# EAGLE schematic STM32 control board - ESCD (EAGLE 9.6.2)
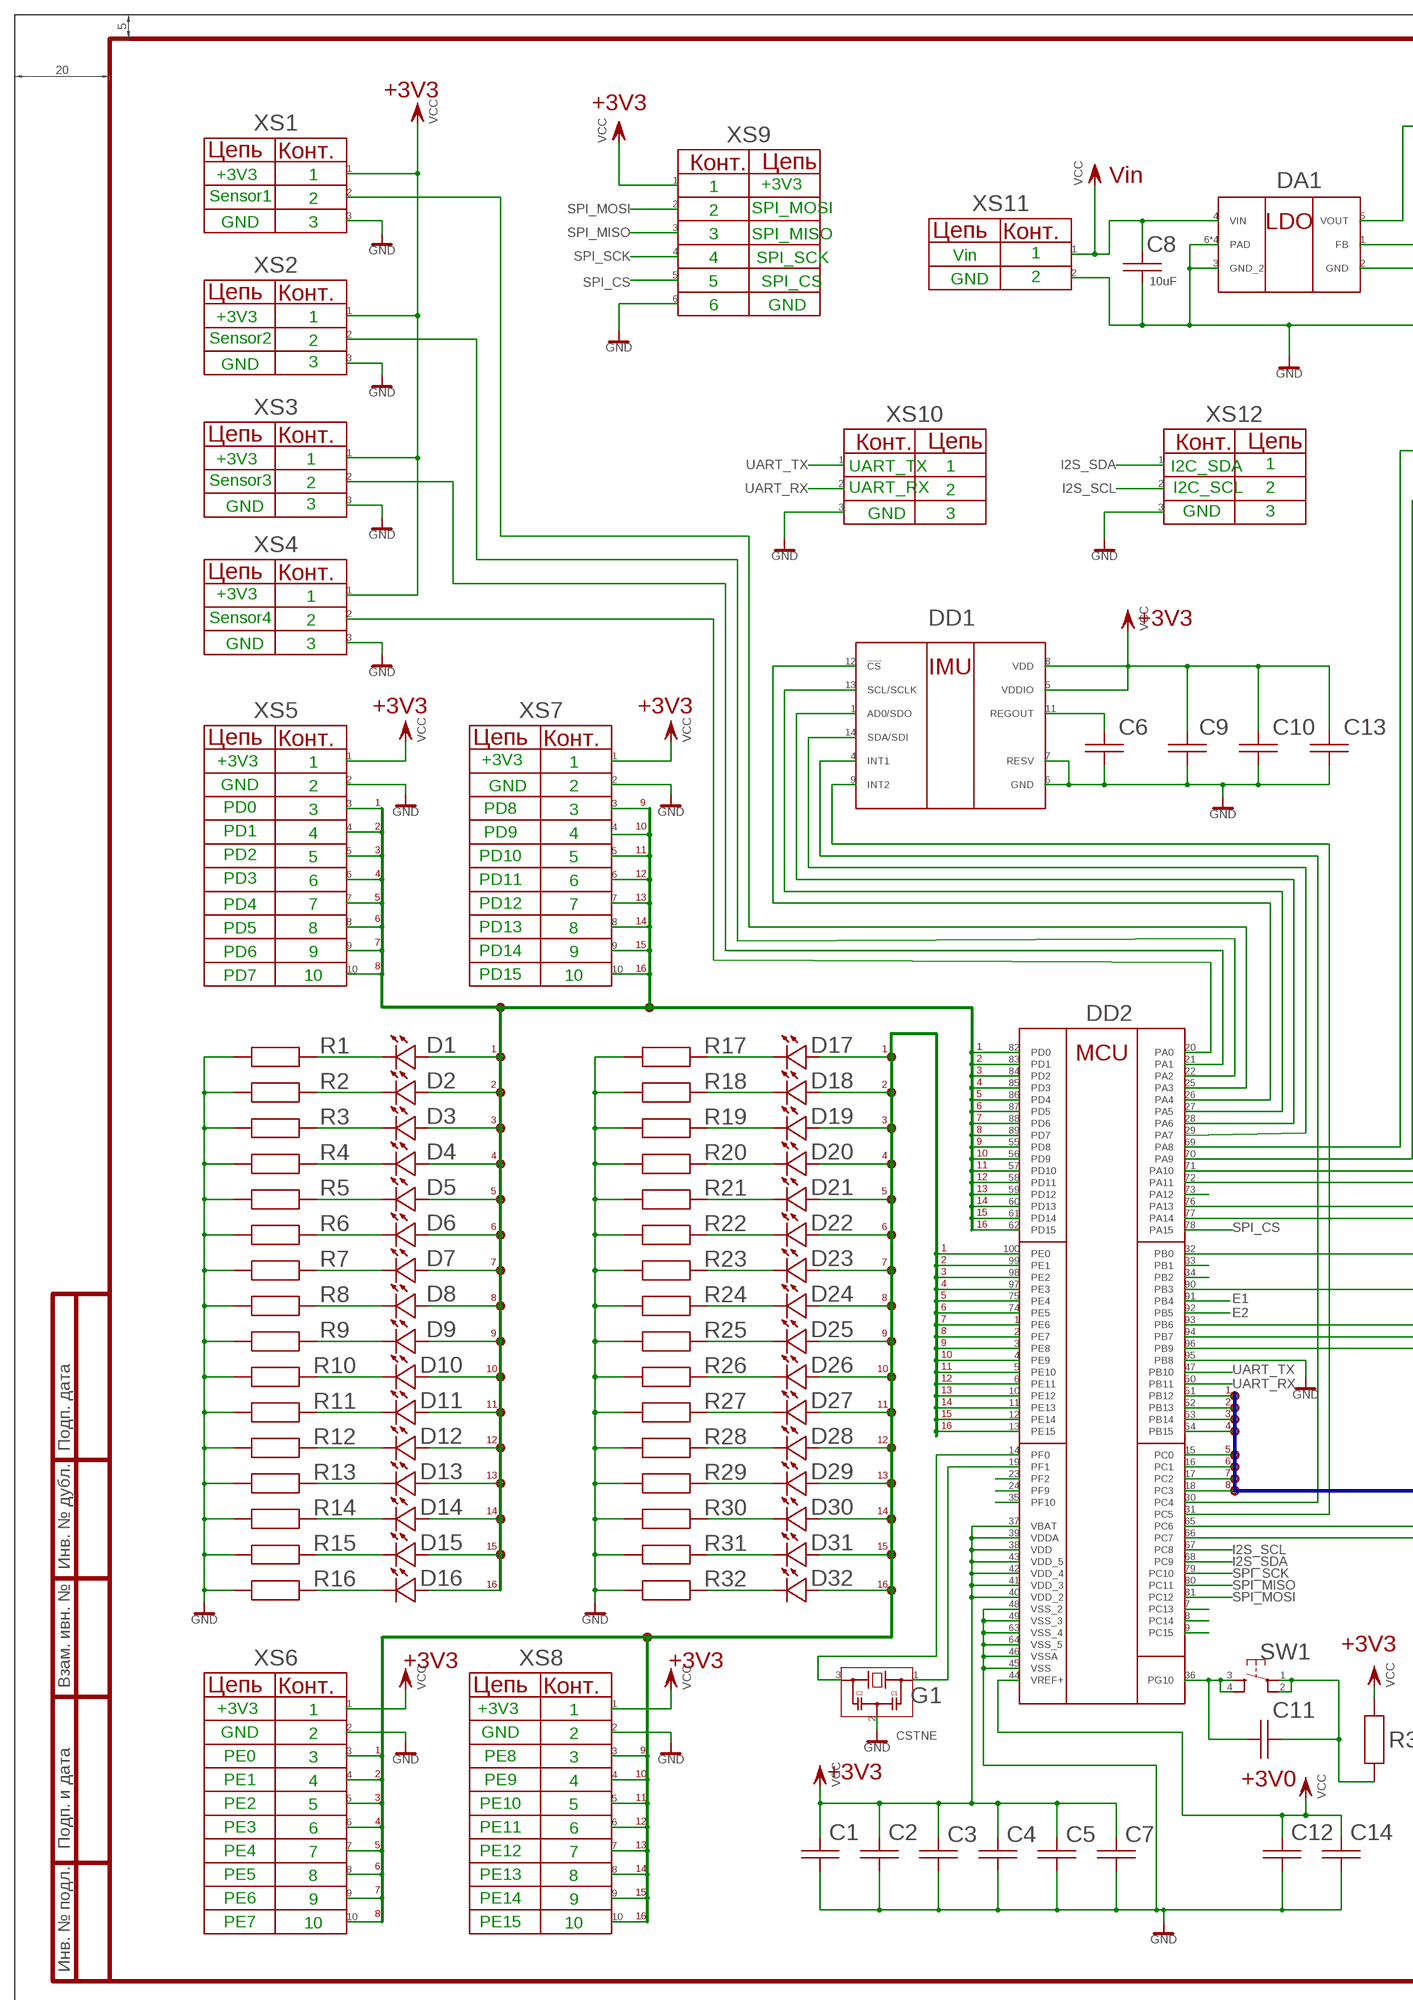
[diagram p0: schematic, sheet 1, part 1 of 2]
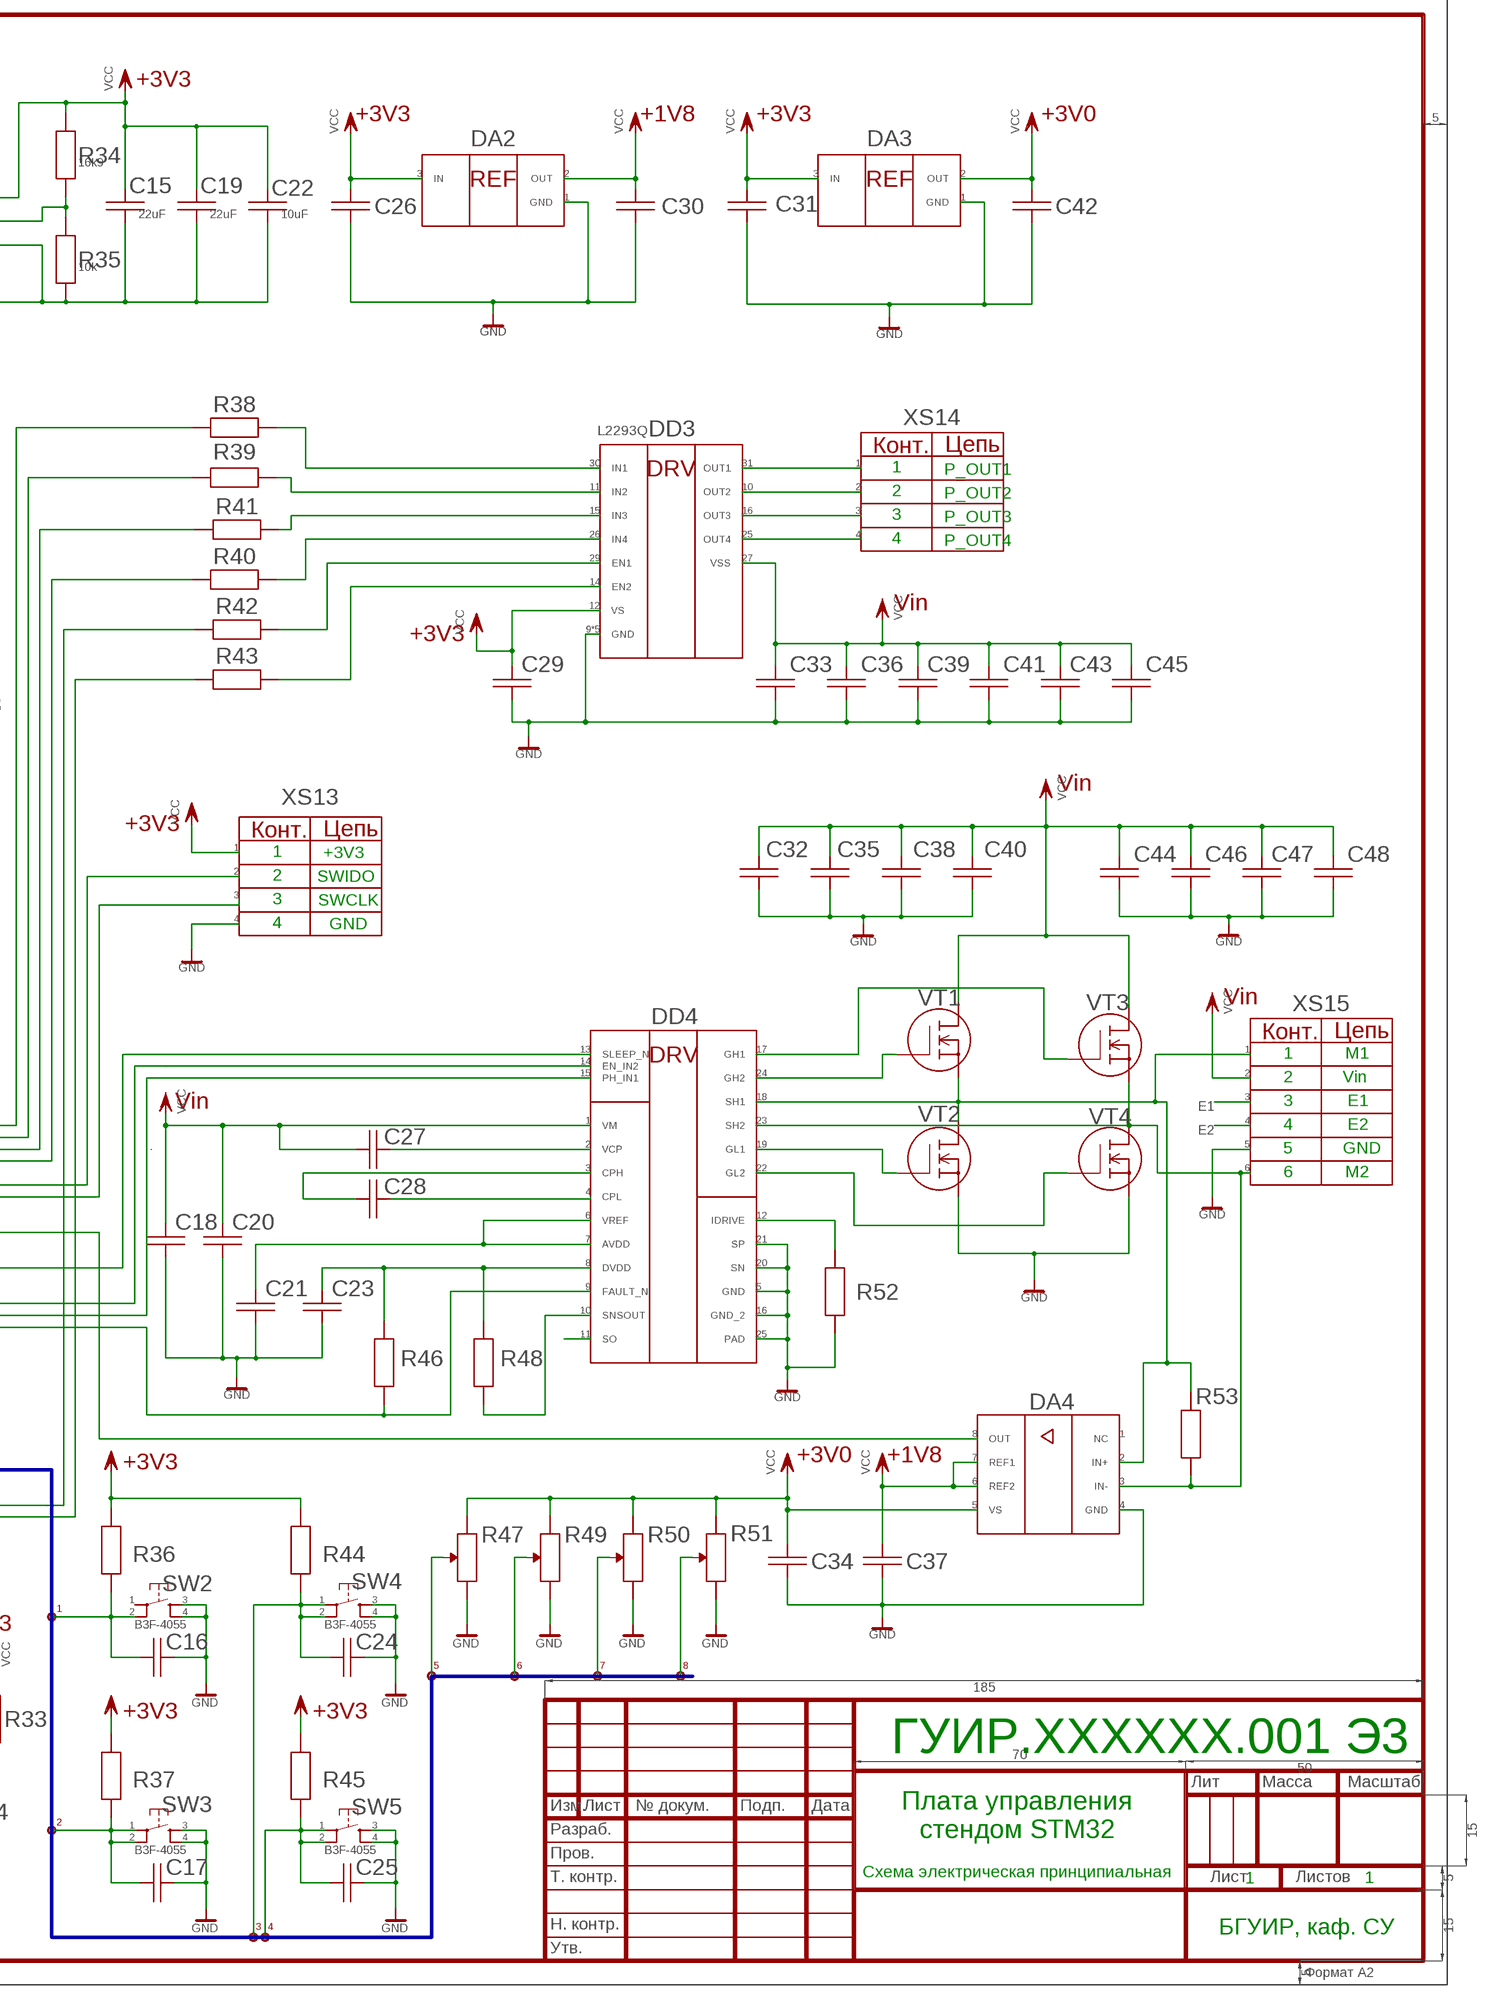
[diagram p1: schematic, sheet 1, part 2 of 2]

## Parts
C1  ESCD_CAP  [C1206]
C2  ESCD_CAP  [C1206]
C3  ESCD_CAP  [C1206]
C4  ESCD_CAP  [C1206]
C5  ESCD_CAP  [C1206]
C6  ESCD_CAP  [C1206]
C7  ESCD_CAP  [C1206]
C8  10uF  ESCD_CAP  [C1206]
C9  ESCD_CAP  [C1206]
C10  ESCD_CAP  [C1206]
C11  ESCD_CAP  [C1206]
C12  ESCD_CAP  [C1206]
C13  ESCD_CAP  [C1206]
C14  ESCD_CAP  [C1206]
C15  22uF  ESCD_CAP  [C1206]
C16  100nF  ESCD_CAP  [C1206]
C17  100nF  ESCD_CAP  [C1206]
C18  ESCD_CAP  [C1206]
C19  22uF  ESCD_CAP  [C1206]
C20  ESCD_CAP  [C1206]
C21  ESCD_CAP  [C1206]
C22  10uF  ESCD_CAP  [C1206]
C23  ESCD_CAP  [C1206]
C24  100nF  ESCD_CAP  [C1206]
C25  100nF  ESCD_CAP  [C1206]
C26  ESCD_CAP  [C1206]
C27  ESCD_CAP  [C1206]
C28  ESCD_CAP  [C1206]
C29  ESCD_CAP  [C1206]
C30  ESCD_CAP  [C1206]
C31  ESCD_CAP  [C1206]
C32  ESCD_CAP  [C1206]
C33  ESCD_CAP  [C1206]
C34  ESCD_CAP  [C1206]
C35  ESCD_CAP  [C1206]
C36  ESCD_CAP  [C1206]
C37  ESCD_CAP  [C1206]
C38  ESCD_CAP  [C1206]
C39  ESCD_CAP  [C1206]
C40  ESCD_CAP  [C1206]
C41  ESCD_CAP  [C1206]
C42  ESCD_CAP  [C1206]
C43  ESCD_CAP  [C1206]
C44  ESCD_CAP  [C1206]
C45  ESCD_CAP  [C1206]
C46  ESCD_CAP  [C1206]
C47  ESCD_CAP  [C1206]
C48  ESCD_CAP  [C1206]
D1  ESCD_LED  [SOD106A]
D2  ESCD_LED  [SOD106A]
D3  ESCD_LED  [SOD106A]
D4  ESCD_LED  [SOD106A]
D5  ESCD_LED  [SOD106A]
D6  ESCD_LED  [SOD106A]
D7  ESCD_LED  [SOD106A]
D8  ESCD_LED  [SOD106A]
D9  ESCD_LED  [SOD106A]
D10  ESCD_LED  [SOD106A]
D11  ESCD_LED  [SOD106A]
D12  ESCD_LED  [SOD106A]
D13  ESCD_LED  [SOD106A]
D14  ESCD_LED  [SOD106A]
D15  ESCD_LED  [SOD106A]
D16  ESCD_LED  [SOD106A]
D17  ESCD_LED  [SOD106A]
D18  ESCD_LED  [SOD106A]
D19  ESCD_LED  [SOD106A]
D20  ESCD_LED  [SOD106A]
D21  ESCD_LED  [SOD106A]
D22  ESCD_LED  [SOD106A]
D23  ESCD_LED  [SOD106A]
D24  ESCD_LED  [SOD106A]
D25  ESCD_LED  [SOD106A]
D26  ESCD_LED  [SOD106A]
D27  ESCD_LED  [SOD106A]
D28  ESCD_LED  [SOD106A]
D29  ESCD_LED  [SOD106A]
D30  ESCD_LED  [SOD106A]
D31  ESCD_LED  [SOD106A]
D32  ESCD_LED  [SOD106A]
DA1  ESCD_LDOSON8  [DRB0008B]
DA2  ESCD_REF  [SOT-23-3]
DA3  ESCD_REF  [SOT-23-3]
DA4  INA240_TSSOP  [TSSOP-8]
DD1  ICM_20600  [14_PIN_LGA]
DD2  ESCD_STM32G4_LPQFP100  [LPQFP-100]
DD3  L2293Q  [QFN_293Q_STM]
DD4  DRV8701  [VQFN-24]
G1  CSTNE  [MURATA_SMD_3P]
R1  ESCD_RES  [R1206]
R2  ESCD_RES  [R1206]
R3  ESCD_RES  [R1206]
R4  ESCD_RES  [R1206]
R5  ESCD_RES  [R1206]
R6  ESCD_RES  [R1206]
R7  ESCD_RES  [R1206]
R8  ESCD_RES  [R1206]
R9  ESCD_RES  [R1206]
R10  ESCD_RES  [R1206]
R11  ESCD_RES  [R1206]
R12  ESCD_RES  [R1206]
R13  ESCD_RES  [R1206]
R14  ESCD_RES  [R1206]
R15  ESCD_RES  [R1206]
R16  ESCD_RES  [R1206]
R17  ESCD_RES  [R1206]
R18  ESCD_RES  [R1206]
R19  ESCD_RES  [R1206]
R20  ESCD_RES  [R1206]
R21  ESCD_RES  [R1206]
R22  ESCD_RES  [R1206]
R23  ESCD_RES  [R1206]
R24  ESCD_RES  [R1206]
R25  ESCD_RES  [R1206]
R26  ESCD_RES  [R1206]
R27  ESCD_RES  [R1206]
R28  ESCD_RES  [R1206]
R29  ESCD_RES  [R1206]
R30  ESCD_RES  [R1206]
R31  ESCD_RES  [R1206]
R32  ESCD_RES  [R1206]
R33  ESCD_RES  [R1206]
R34  16k9  ESCD_RES  [R1206]
R35  10k  ESCD_RES  [R1206]
R36  10k  ESCD_RES  [R1206]
R37  10k  ESCD_RES  [R1206]
R38  ESCD_RES  [R1206]
R39  ESCD_RES  [R1206]
R40  ESCD_RES  [R1206]
R41  ESCD_RES  [R1206]
R42  ESCD_RES  [R1206]
R43  ESCD_RES  [R1206]
R44  10k  ESCD_RES  [R1206]
R45  10k  ESCD_RES  [R1206]
R46  ESCD_RES  [R1206]
R47  ESCD_RES_POT  [ALPS_PTM_LONG]
R48  ESCD_RES  [R1206]
R49  ESCD_RES_POT  [ALPS_PTM_LONG]
R50  ESCD_RES_POT  [ALPS_PTM_LONG]
R51  ESCD_RES_POT  [ALPS_PTM_LONG]
R52  ESCD_RES  [R1206]
R53  ESCD_RES  [R1206]
SW1  B3F-4055  [SWITCH_B3F-4055]
SW2  B3F-4055  [SWITCH_B3F-4055]
SW3  B3F-4055  [SWITCH_B3F-4055]
SW4  B3F-4055  [SWITCH_B3F-4055]
SW5  B3F-4055  [SWITCH_B3F-4055]
VT1  MOSFET_GOST  [MOSFET]
VT2  MOSFET_GOST  [MOSFET]
VT3  MOSFET_GOST  [MOSFET]
VT4  MOSFET_GOST  [MOSFET]
XS1  ESCD_CONNECTOR_3POS  [S3B-PH-SM4-TB]
XS2  ESCD_CONNECTOR_3POS  [S3B-PH-SM4-TB]
XS3  ESCD_CONNECTOR_3POS  [S3B-PH-SM4-TB]
XS4  ESCD_CONNECTOR_3POS  [S3B-PH-SM4-TB]
XS5  ESCD_CONNECTOR_10POS  [S10B-PH-SM4-TB]
XS6  ESCD_CONNECTOR_10POS  [S10B-PH-SM4-TB]
XS7  ESCD_CONNECTOR_10POS  [S10B-PH-SM4-TB]
XS8  ESCD_CONNECTOR_10POS  [S10B-PH-SM4-TB]
XS9  ESCD_CONNECTOR_6POS  [S6B-PH-SM4-TB]
XS10  ESCD_CONNECTOR_3POS  [S3B-PH-SM4-TB]
XS11  ESCD_CONNECTOR_2POS  [S2B-PH-SM4-TB]
XS12  ESCD_CONNECTOR_3POS  [S3B-PH-SM4-TB]
XS13  ESCD_CONNECTOR_4POS  [S4B-PH-K]
XS14  ESCD_CONNECTOR_4POS  [S4B-PH-K]
XS15  ESCD_CONNECTOR_6POS  [S6B-PH-SM4-TB]

## Nets
1: XS12.1
2: XS9.2 XS12.2
3: XS9.3 XS12.3 XS13.4 XS15.3 ; supply symbol labelled GND
4: XS9.4
5: XS9.5
6: XS9.6 ; supply symbol labelled GND
+3V3: R36.2 R37.2 R44.2 R45.2 ; supply symbol labelled VCC
B$1: C16.1 C17.1 C24.1 C25.1 DD2.15(PC0) DD2.16(PC1) DD2.17(PC2) DD2.18(PC3) DD2.51(PB12) DD2.52(PB13) DD2.53(PB14) DD2.54(PB15) R36.1 R37.1 R44.1 R45.1 R49.P$3 R50.P$3 R51.P$3 SW2.2 SW3.1 SW3.2 SW4.1 SW4.2 SW5.1 SW5.2
E1: DD2.91(PB4)
E2: DD2.92(PB5) XS15.4
GND: C6.2 C8.2 C9.2 C10.2 C13.2 C15.2 C16.2 C17.2 C18.2 C19.2 C20.2 C21.2 C22.2 C23.2 C24.2 C25.2 C26.2 C29.2 C30.2 C31.2 C32.2 C33.2 C34.2 C35.2 C36.2 C37.2 C38.2 C39.2 C40.2 C41.2 C42.2 C43.2 C44.2 C45.2 C46.2 C47.2 C48.2 DA1.2(GND) DA1.3(GND_2) DA1.6(PAD) DA1.7(PAD) DA1.8(PAD) DA1.9(PAD) DA2.1(GND) DA3.1(GND) DA4.4(GND) DD1.6(GND) DD1.7(RESV) DD2.95(PB8) DD3.9(GND) DD3.17(GND) DD3.24(GND) DD3.28(GND) DD3.32(GND) DD4.5(GND) DD4.16(GND_2) DD4.20(SN) DD4.21(SP) DD4.25(PAD) G1.2(GND) R1.2 R2.2 R3.2 R4.2 R5.2 R6.2 R7.2 R8.2 R9.2 R10.2 R11.2 R12.2 R13.2 R14.2 R15.2 R16.2 R17.2 R18.2 R19.2 R20.2 R21.2 R22.2 R23.2 R24.2 R25.2 R26.2 R27.2 R28.2 R29.2 R30.2 R31.2 R32.2 R35.1 R47.P$1 R49.P$1 R50.P$1 R51.P$1 R52.1 SW2.3 SW2.4 SW3.3 SW3.4 SW4.3 SW4.4 SW5.3 SW5.4 VT2.P$1 VT4.P$1 XS1.3 XS2.3 XS3.3 XS4.3 XS6.2 XS7.2 XS8.2 XS10.3 XS11.2 XS15.5
I2S_SCL: DD2.67(PC8)
I2S_SDA: DD2.68(PC9)
N$1: DD2.25(PA3) XS1.2
N$2: XS5.1 ; supply symbol labelled VCC
N$4: DD2.7(PC13)
N$7: D17.K R17.1
N$12: DD2.22(PA2) XS2.2
N$13: D18.K R18.1
N$14: D19.K R19.1
N$17: D20.K R20.1
N$19: D21.K R21.1
N$20: D22.K R22.1
N$21: DA1.1(FB) R34.1 R35.2
N$22: D23.K R23.1
N$23: DD1.4(INT1) DD2.30(PC4)
N$25: DD1.9(INT2) DD2.31(PC5)
N$26: C1.2 C2.2 C3.2 C4.2 C5.2 C7.2 C12.2 C14.2 DD2.45(VSS) DD2.46(VSSA) DD2.48(VSS_2) DD2.49(VSS_3) DD2.63(VSS_4) DD2.64(VSS_5)
N$27: DD1.12(!CS) DD2.26(PA4)
N$28: DD1.13(SCL/SCLK) DD2.27(PA5)
N$29: DD1.1(AD0/SDO) DD2.28(PA6)
N$30: DD1.14(SDA/SDI) DD2.29(PA7)
N$31: DD2.69(PA8) R38.1
N$34: DD2.70(PA9) R39.1
N$35: D17.A D18.A D19.A D20.A D21.A D22.A D23.A D24.A D25.A D26.A D27.A D28.A D29.A D30.A D31.A D32.A DD2.1(PE6) DD2.2(PE7) DD2.3(PE8) DD2.4(PE9) DD2.5(PE10) DD2.6(PE11) DD2.10(PE12) DD2.11(PE13) DD2.12(PE14) DD2.13(PE15) DD2.74(PE5) DD2.75(PE4) DD2.97(PE3) DD2.98(PE2) DD2.99(PE1) DD2.100(PE0) XS6.3 XS6.4 XS6.5 XS6.6 XS6.7 XS6.8 XS6.9 XS6.10 XS8.3 XS8.4 XS8.5 XS8.6 XS8.7 XS8.8 XS8.9 XS8.10
N$36: DD2.72(PA11) R40.1
N$38: DD2.73(PA12)
N$39: XS13.2
N$40: DD2.77(PA14) XS13.3
N$41: DD2.71(PA10) R41.1
N$42: DD2.20(PA0) XS4.2
N$43: DD2.21(PA1) XS3.2
N$44: XS5.2 ; supply symbol labelled GND
N$46: C6.1 DD1.11(REGOUT)
N$47: DD3.14(EN2) R43.2
N$48: DD2.65(PC6) R42.1
N$49: DD2.66(PC7) R43.1
N$50: DD3.10(OUT2) XS14.2
N$51: D24.K R24.1
N$52: D25.K R25.1
N$53: D26.K R26.1
N$54: D27.K R27.1
N$55: D28.K R28.1
N$56: D29.K R29.1
N$57: D30.K R30.1
N$58: D31.K R31.1
N$59: D32.K R32.1
N$61: DD3.31(OUT1) XS14.1
N$62: DD3.16(OUT3) XS14.3
N$63: DD3.25(OUT4) XS14.4
N$64: DD2.93(PB6) DD4.14(EN_IN2)
N$65: DD3.29(EN1) R42.2
N$66: DD3.15(IN3) R41.2
N$67: DD3.30(IN1) R38.2
N$68: DD3.11(IN2) R39.2
N$69: DD2.34(PB2)
N$70: DD3.26(IN4) R40.2
N$71: DD2.33(PB1)
N$72: DD2.90(PB3) DD4.13(SLEEP_N)
N$73: DD2.94(PB7) DD4.15(PH_IN1)
N$74: DA4.8(OUT) DD2.32(PB0)
N$76: D1.K R1.1
N$77: D2.K R2.1
N$78: D3.K R3.1
N$79: D4.K R4.1
N$80: D5.K R5.1
N$81: D6.K R6.1
N$82: D7.K R7.1
N$83: D8.K R8.1
N$84: D9.K R9.1
N$85: D10.K R10.1
N$86: D11.K R11.1
N$87: D12.K R12.1
N$88: D13.K R13.1
N$89: D14.K R14.1
N$90: D15.K R15.1
N$91: D16.K R16.1
N$92: D1.A D2.A D3.A D4.A D5.A D6.A D7.A D8.A D9.A D10.A D11.A D12.A D13.A D14.A D15.A D16.A DD2.55(PD8) DD2.56(PD9) DD2.57(PD10) DD2.58(PD11) DD2.59(PD12) DD2.60(PD13) DD2.61(PD14) DD2.62(PD15) DD2.82(PD0) DD2.83(PD1) DD2.84(PD2) DD2.85(PD3) DD2.86(PD4) DD2.87(PD5) DD2.88(PD6) DD2.89(PD7) XS5.3 XS5.4 XS5.5 XS5.6 XS5.7 XS5.8 XS5.9 XS5.10 XS7.3 XS7.4 XS7.5 XS7.6 XS7.7 XS7.8 XS7.9 XS7.10
N$93: DD2.19(PF1) G1.1(IN)
N$94: DD2.14(PF0) G1.3(OUT)
N$95: DD2.23(PF2)
N$96: DD2.24(PF9)
N$97: DD2.35(PF10)
N$98: C11.2 DD2.36(PG10) SW1.3 SW1.4
N$100: C11.1 R33.1 SW1.1 SW1.2
N$101: DD4.17(GH1) VT3.P$3
N$102: DD2.8(PC14)
N$103: DD2.9(PC15)
N$104: C27.2 DD4.2(VCP)
N$105: C28.2 DD4.4(CPL)
N$106: C28.1 DD4.3(CPH)
N$107: DD4.24(GH2) VT1.P$3
N$108: C21.1 DD4.6(VREF) DD4.7(AVDD)
N$109: C23.1 DD4.8(DVDD) R46.2 R48.2
N$110: DD4.10(SNSOUT) R48.1
N$111: DD2.96(PB9) DD4.9(FAULT_N) R46.1
N$112: DD4.12(IDRIVE) R52.2
N$113: DD4.11(SO)
N$114: DD4.19(GL1) VT2.P$3
N$115: R47.P$3
N$116: DA4.3(IN-) DD4.23(SH2) R53.1 VT3.P$1 VT4.P$2 XS15.6
N$117: DA4.2(IN+) DD4.18(SH1) R53.2 VT1.P$1 VT2.P$2 XS15.1
N$118: DD4.22(GL2) VT4.P$3
SPI_CS: DD2.78(PA15)
SPI_MISO: DD2.80(PC11)
SPI_MOSI: DD2.81(PC12)
SPI_SCK: DD2.79(PC10)
UART_RX: DD2.50(PB11) XS10.2
UART_TX: DD2.47(PB10) XS10.1
VCC: C1.1 C2.1 C3.1 C4.1 C5.1 C7.1 C8.1 C9.1 C10.1 C12.1 C13.1 C14.1 C15.1 C18.1 C19.1 C20.1 C22.1 C26.1 C27.1 C29.1 C30.1 C31.1 C33.1 C34.1 C36.1 C37.1 C39.1 C41.1 C42.1 C43.1 C45.1 DA1.4(VIN) DA1.5(VOUT) DA2.2(OUT) DA2.3(IN) DA3.2(OUT) DA3.3(IN) DA4.5(VS) DA4.6(REF2) DA4.7(REF1) DD1.5(VDDIO) DD1.8(VDD) DD2.37(VBAT) DD2.38(VDD) DD2.39(VDDA) DD2.40(VDD_2) DD2.41(VDD_3) DD2.42(VDD_4) DD2.43(VDD_5) DD2.44(VREF+) DD3.12(VS) DD3.27(VSS) DD4.1(VM) R33.2 R34.2 R47.P$2 R49.P$2 R50.P$2 R51.P$2 XS1.1 XS2.1 XS3.1 XS4.1 XS6.1 XS7.1 XS8.1 XS9.1 XS11.1 XS13.1 XS15.2
VCC1: C32.1 C35.1 C38.1 C40.1 C44.1 C46.1 C47.1 C48.1 VT1.P$2 VT3.P$2 ; supply symbol labelled VCC
Unconnected: DA4.1(NC) DD2.76(PA13) SW2.1

## Buses
B$1

## Notes on the sheet
- +3V3
- +3V3 | +3V3
- +3V3 | +1V8 | +3V3 | +3V0
- +3V3 | 1 | Vin
- 1 | +3V3
- Sensor1 | 2
- 2 | SPI_MOSI
- GND | 3
- 3 | SPI_MISO
- 4 | SPI_SCK | Vin | 1
- 5 | SPI_CS | GND | 2
- 6 | GND
- +3V3 | 1
- Sensor2 | 2
- GND | 3
- +3V3 | 1 | 1
- UART_TX | 1 | I2C_SDA
- Sensor3 | 2
- UART_RX | 2 | I2C_SCL | 2 | 1 | P_OUT1
- GND | 3
- GND | 3 | GND | 3 | 2 | P_OUT2
- 3 | P_OUT3
- 4 | P_OUT4
- +3V3 | 1
- +3V3
- Sensor4 | 2
- Vin
- GND | 3 | +3V3
- +3V3 | +3V3
- +3V3 | +3V3
- 1 | 1
- GND
- 2 | GND | 2
- 1 | PD8 | 9
- PD0 | 3 | 3 | Vin
- 2 | PD9 | 10
- PD1 | 4 | 4 | +3V3
- 3 | PD10 | 11
- PD2 | 5 | 5
- 4 | PD11 | 12 | 1 | +3V3
- PD3 | 6 | 6
- 5 | PD12 | 13 | 2 | SWIDO
- PD4 | 7 | 7
- 6 | 14 | SWCLK
- PD13 | 3
- PD5 | 8 | 8
- 7 | 15 | GND
- PD14 | 4
- PD6 | 9 | 9
- 8 | 16
- PD15
- PD7 | 10 | 10
- Vin
- 1 | 1 | 1
- 2
- 3
- 1 | M1
- 2 | 2 | 4
- 5
- 2 | Vin
- 6
- 3 | 3 | 7
- Vin | 3 | E1
- 8
- 9
- 4 | E2
- 4 | 4 | 10
- 11
- 5 | GND
- 12
- 5 | 5 | 13
- 6 | M2
- 14
- 15
- 6 | 6 | 16
- 1
- 7 | 7 | 2
- 3
- 4
- 8 | 8 | 5
- 6
- 7
- 9 | 9 | 8
- 9
- 10
- 10 | 10 | 11
- 12
- 13 | 1
- 11 | 11 | 14 | 2
- 15 | 3
- 16 | 4
- 12 | 12
- 5
- 6
- 7 | +3V3
- 13 | 13
- +3V0 | +1V8
- 8
- 14 | 14
- 15 | 15
- 16 | 16
- +3V3 | 1
- +3V3 | +3V3
- 5 | 6 | 7 | 8
- +3V3 | +3V3
- 1 | 1
- +3V3 | +3V3
- GND | GND
- 2 | 2
- PE0 | 1 | PE8 | 9
- 3 | 3 | +3V3
- ГУИР.ХХХХХХ.001 Э3
- PE1 | 2 | PE9 | 10
- 4 | 4 | +3V0
- PE2 | 3 | PE10 | 11
- 5 | 5
- PE3 | 4 | PE11 | 12
- 6 | 6
- Плата управления
  стендом STM32
- 5 | 13 | 2
- PE4 | PE12
- 7 | 7
- 6 | 14
- PE5 | PE13
- 8 | 8
- 7 | Схема электрическая принципиальная
- PE6 | PE14 | 15 | 1 | 1
- 9 | 9
- 8 | 16
- PE7 | PE15
- 10 | 10
- БГУИР, каф. СУ
- 3 | 4

## Library data of the parts
C1-C48 = ESCD:ESCD_CAP
D1-D32 = ESCD:ESCD_LED: DIODE; MPN: BYS10/45; OC_FARNELL: 9549188; OC_NEWARK: 96K7236
DA1 = ESCD:ESCD_LDO: 40-V, 450-mA, Wide VIN, Low IQ, Low-Dropout Voltage Regulator; DATASHEET: https://www.ti.com/lit/ds/symlink/tps7a19.pdf?ts=1594646251403&ref_url=https%253A%252F%252Fwww.google.com%252F; MANUFACTURER_PART_NUMBER: TPS7A1901DRBT
DA2 DA3 = ESCD:ESCD_REF
DA4 = ESCD:INA240_TSSOP
DD1 = ESCD:ICM_20600: 6-axis IMU Model suitable for ICM-20600 Created: 18.10.19 by Andrey Dovnar, andrevdovnar@gmail.com Updated: 16.11.19 by Andrey Dovnar, andrevdovnar@gmail.com
DD2 = ESCD:ESCD_STM32G4_LPQFP100; BUILT_BY: EMA_Jessica; COPYRIGHT: Copyright (C) 2016 Accelerated Designs. All rights reserved; MANUFACTURER_PART_NUMBER: STM32G4_LPQFP100_T1; VENDOR: STMicroelectronics
DD3 = ESCD:L2293Q; MANUFACTURER_PART_NUMBER: L2293Q
DD4 = ESCD:DRV8701: Suitable for TI DRV8701P/(E) : H - driver with 47V max Vin and external MOSFETs
G1 = ESCD:CSTNE: Ceramic Resonator with integrated load capacitors No external components required Model suitable for all Murata electronics resonators from CSTNE_G, CSTNE_V, CSTNE_VH3L and CSTNE_GH5L families Created: 16.11.19 by Andrey Dovnar, andrevdovnar@gmail.com
R1-R46 R48 R52 R53 = ESCD:ESCD_RES
R47 R49-R51 = ESCD:ESCD_RES_POT
SW1-SW5 = ESCD:B3F-4055; BUILT_BY: EMA_Cory; COPYRIGHT: Copyright (C) 2018 Accelerated Designs. All rights reserved; MANUFACTURER_PART_NUMBER: B3F-4055; VENDOR: Omron
VT1-VT4 = ESCD:MOSFET_GOST
XS1-XS4 XS10 XS12 = ESCD:ESCD_CONNECTOR_3POS: Wire to board connector Model suitable for S4B-PH-K Updated: 21.10.19 by Andrey Dovnar, andrevdovnar@gmail.com
XS5-XS8 = ESCD:ESCD_CONNECTOR_10POS: Wire to board connector Model suitable for S4B-PH-K Updated: 21.10.19 by Andrey Dovnar, andrevdovnar@gmail.com
XS9 XS15 = ESCD:ESCD_CONNECTOR_6POS: Wire to board connector Model suitable for S4B-PH-K Updated: 21.10.19 by Andrey Dovnar, andrevdovnar@gmail.com
XS11 = ESCD:ESCD_CONNECTOR_2POS: Wire to board connector Model suitable for S4B-PH-K Updated: 21.10.19 by Andrey Dovnar, andrevdovnar@gmail.com
XS13 XS14 = ESCD:ESCD_CONNECTOR_4POS: Wire to board connector Model suitable for S4B-PH-K Updated: 21.10.19 by Andrey Dovnar, andrevdovnar@gmail.com

## Net classes
3 POWER: clearance 0.2 mm